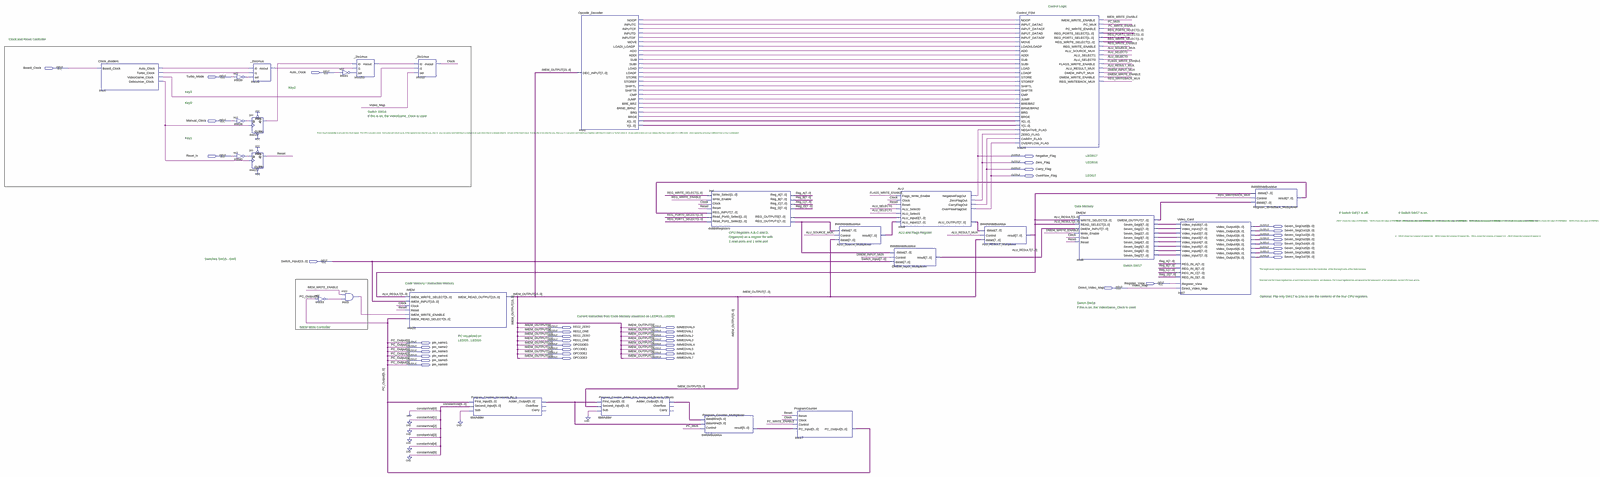
[diagram p0: schematic sheet, whole]
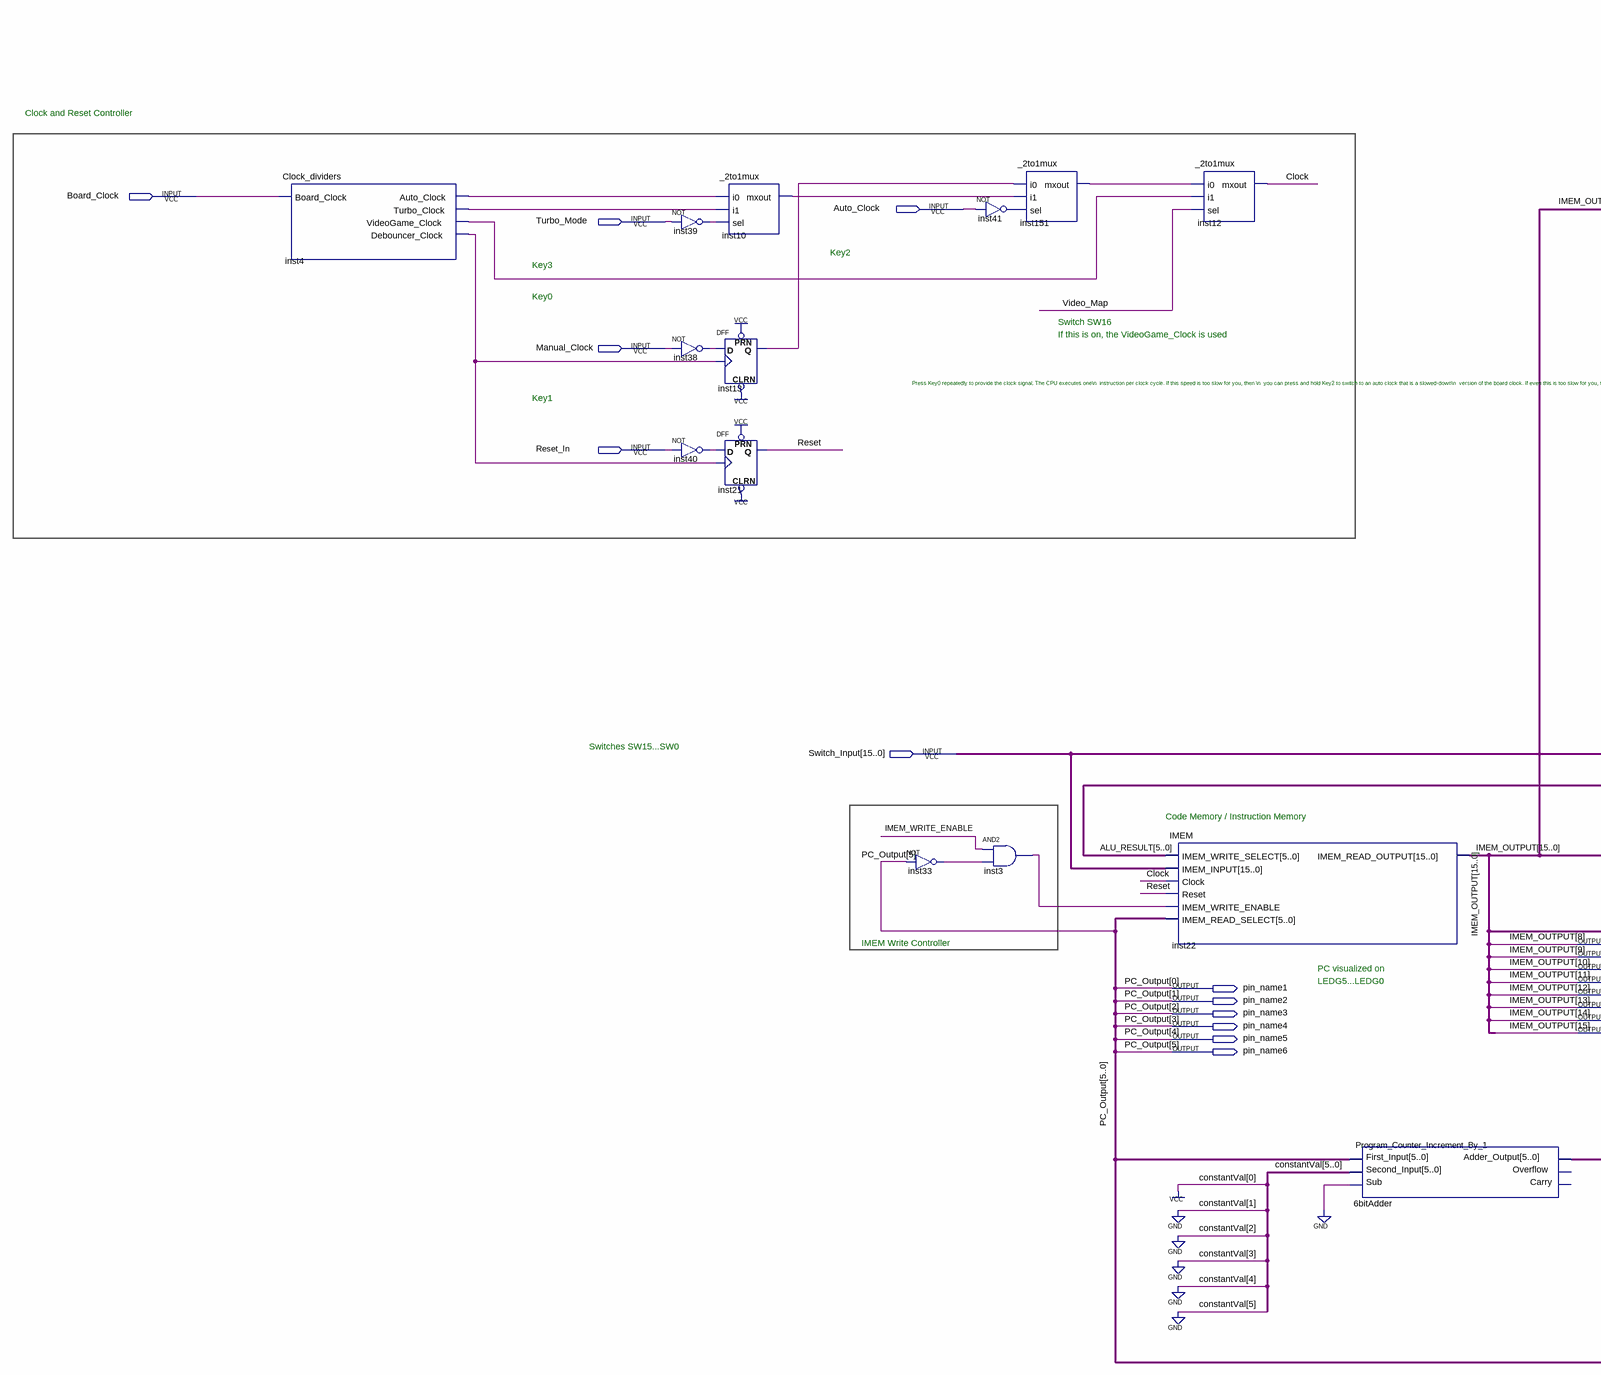
[diagram p1: schematic sheet, left part]
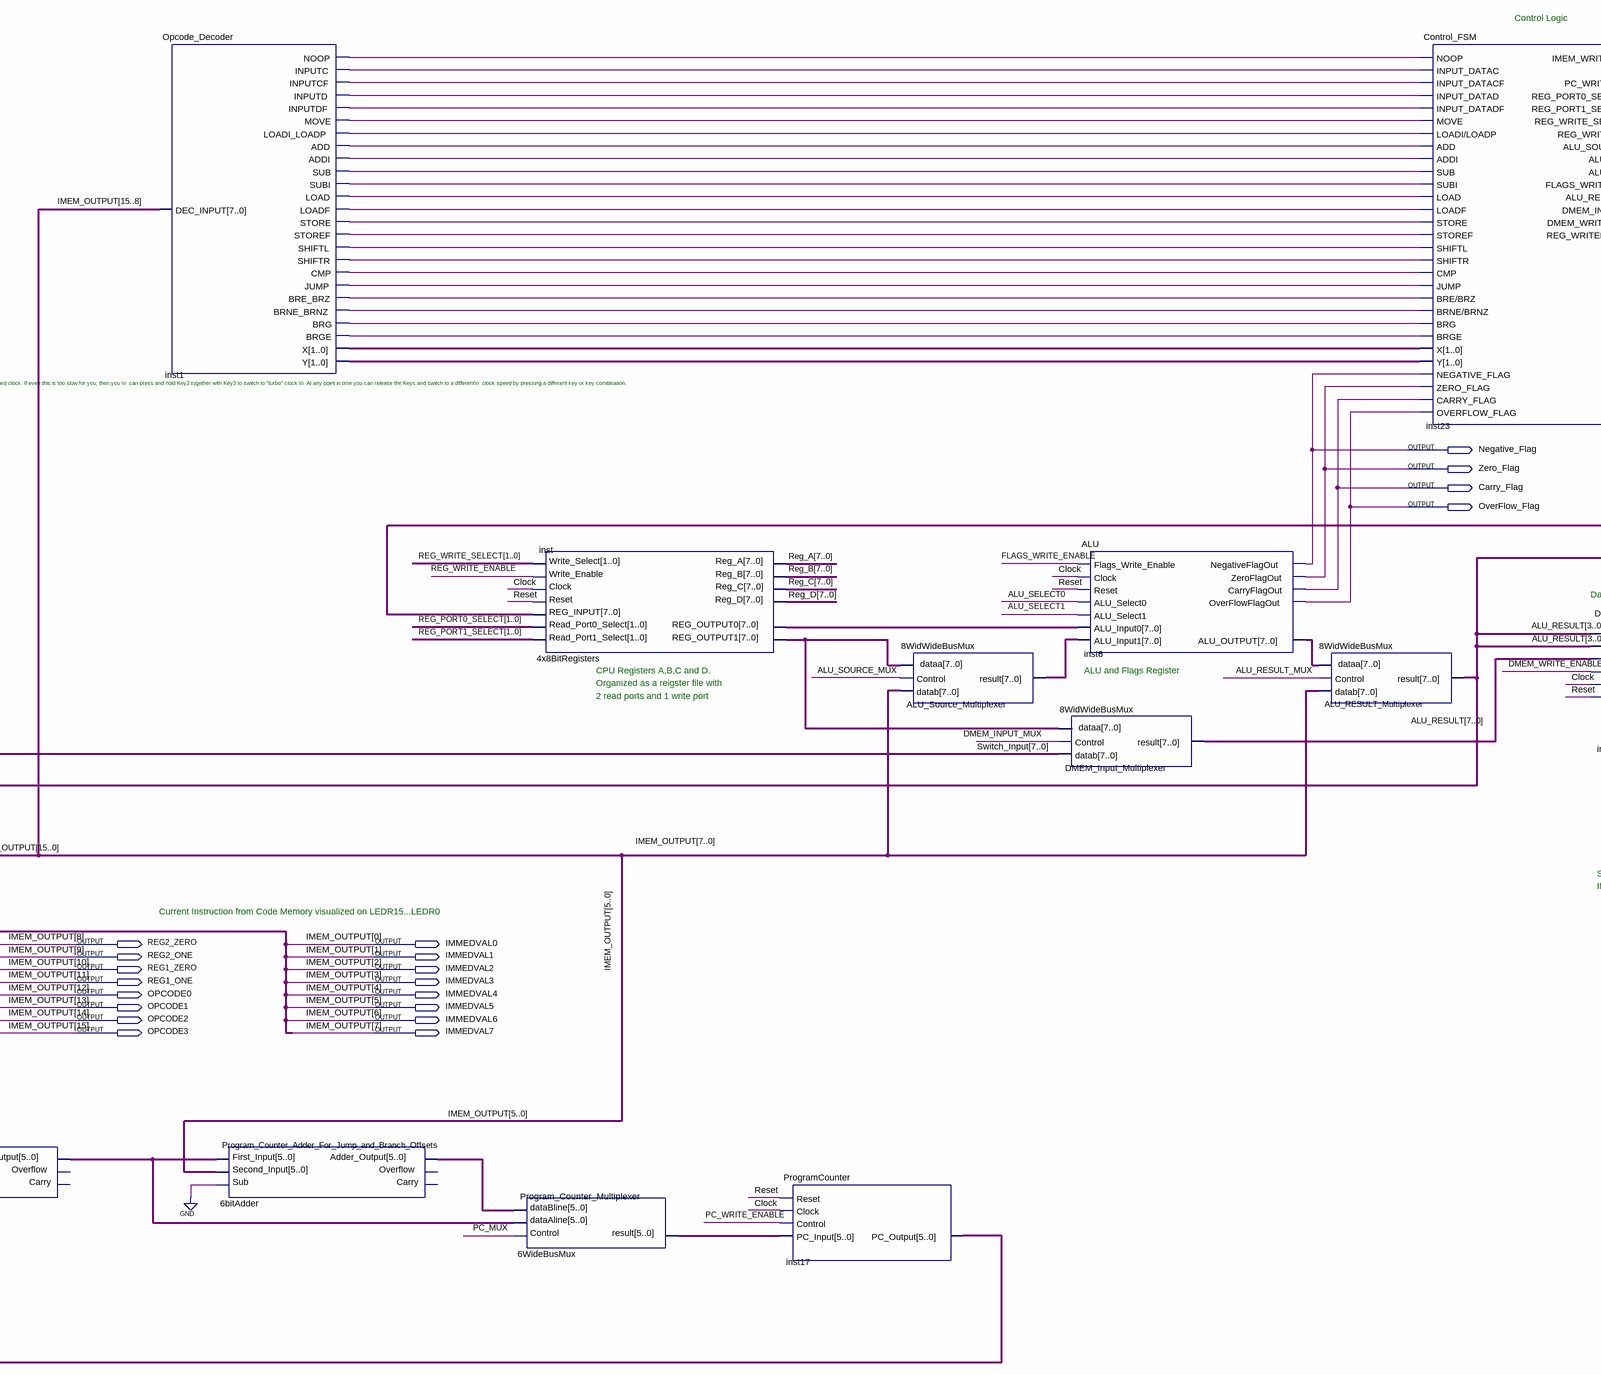
[diagram p2: schematic sheet, centre part]
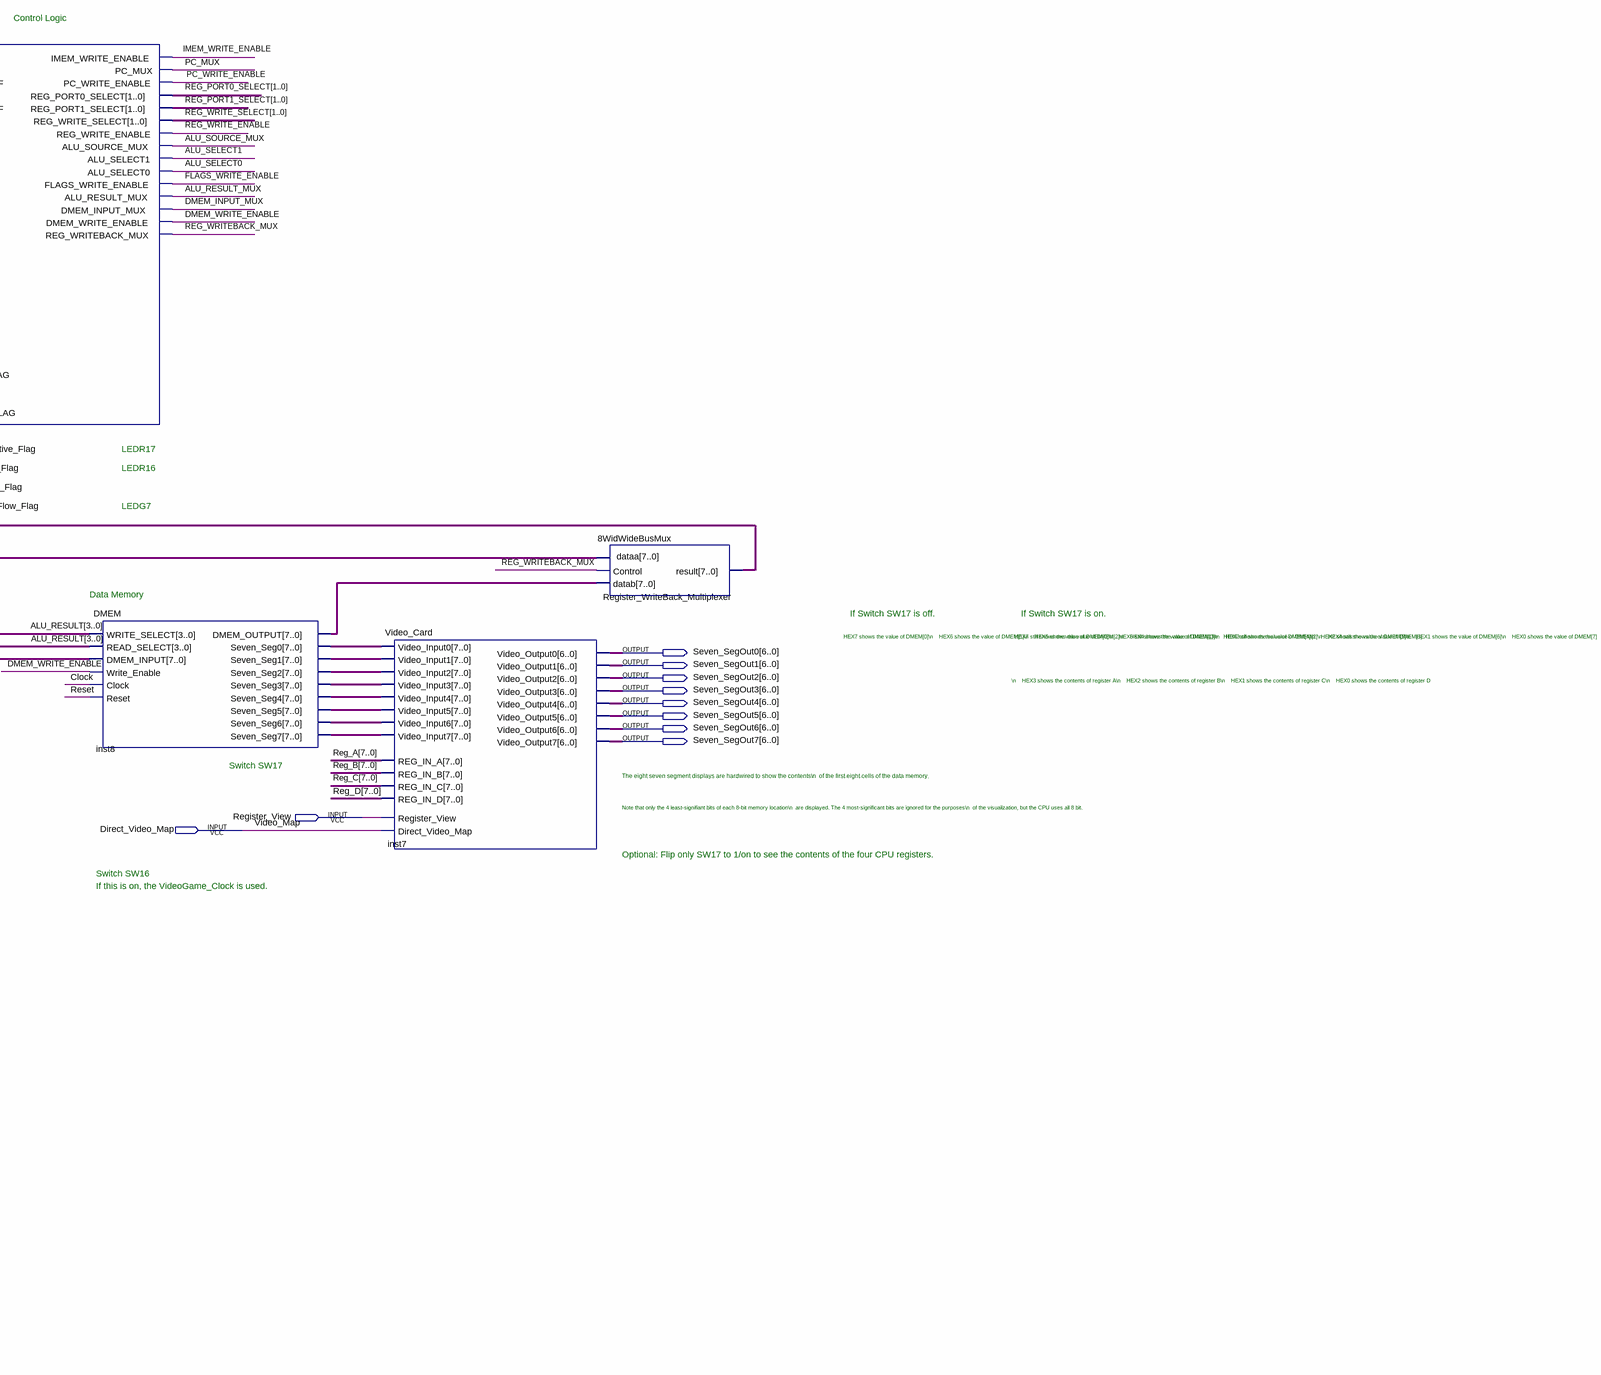
[diagram p3: schematic sheet, right part]
// Quartus schematic i281_CPU.bdf as structural Verilog: 27 symbols, 42 pins
module i281_CPU (
  input  Board_Clock,
  input  Auto_Clock,
  input  Turbo_Mode,
  input  Manual_Clock,
  input  Reset_In,
  input  [15:0] Switch_Input,
  input  Register_View,
  input  Direct_Video_Map,
  output Negative_Flag,
  output Zero_Flag,
  output Carry_Flag,
  output OverFlow_Flag,
  output [6:0] Seven_SegOut0,
  output [6:0] Seven_SegOut1,
  output [6:0] Seven_SegOut2,
  output [6:0] Seven_SegOut3,
  output [6:0] Seven_SegOut4,
  output [6:0] Seven_SegOut5,
  output [6:0] Seven_SegOut6,
  output [6:0] Seven_SegOut7,
  output REG2_ZERO,
  output IMMEDVAL0,
  output REG2_ONE,
  output IMMEDVAL1,
  output REG1_ZERO,
  output IMMEDVAL2,
  output REG1_ONE,
  output IMMEDVAL3,
  output pin_name1,
  output OPCODE0,
  output IMMEDVAL4,
  output pin_name2,
  output OPCODE1,
  output IMMEDVAL5,
  output pin_name3,
  output OPCODE2,
  output IMMEDVAL6,
  output pin_name4,
  output OPCODE3,
  output IMMEDVAL7,
  output pin_name5,
  output pin_name6
);

  wire ALU_RESULT_MUX, ALU_SELECT0, ALU_SELECT1, ALU_SOURCE_MUX, Clock, DMEM_INPUT_MUX, DMEM_WRITE_ENABLE,
       FLAGS_WRITE_ENABLE, IMEM_WRITE_ENABLE, inst1_add, inst1_addi, inst1_bre_brz, inst1_brg, inst1_brge,
       inst1_brne_brnz, inst1_cmp, inst1_inputc, inst1_inputcf, inst1_inputd, inst1_inputdf, inst1_jump,
       inst1_load, inst1_loadf, inst1_loadi_loadp, inst1_move, inst1_noop, inst1_shiftl, inst1_shiftr,
       inst1_store, inst1_storef, inst1_sub, inst1_subi, inst3_out, inst4_auto_clock, inst4_debouncer_clock,
       inst4_turbo_clock, inst4_videogame_clock, inst10_mxout, inst13_q, inst33_out, inst38_out, inst39_out,
       inst40_out, inst41_out, inst151_mxout, PC_MUX, PC_WRITE_ENABLE, REG_WRITE_ENABLE, REG_WRITEBACK_MUX,
       Reset;
  wire [1:0] inst1_x, inst1_y, REG_PORT0_SELECT, REG_PORT1_SELECT, REG_WRITE_SELECT;
  wire [5:0] Program_Counter_Adder_For_Jump_and_Branch_Offsets_adder_output,
       Program_Counter_Increment_By_1_adder_output, Program_Counter_Multiplexer_result;
  wire [7:0] ALU_RESULT, ALU_Source_Multiplexer_result, DMEM_Input_Multiplexer_result, inst6_alu_output,
       inst8_dmem_output, inst8_seven_seg0, inst8_seven_seg1, inst8_seven_seg2, inst8_seven_seg3,
       inst8_seven_seg4, inst8_seven_seg5, inst8_seven_seg6, inst8_seven_seg7, inst_reg_output0,
       inst_reg_output1, Reg_A, Reg_B, Reg_C, Reg_D, Register_WriteBack_Multiplexer_result;

  Clock_dividers inst4 (
    .Board_Clock(Board_Clock), .Auto_Clock(inst4_auto_clock), .Turbo_Clock(inst4_turbo_clock),
    .VideoGame_Clock(inst4_videogame_clock), .Debouncer_Clock(inst4_debouncer_clock));
  not inst39 (inst39_out, Turbo_Mode);
  not inst38 (inst38_out, Manual_Clock);
  not inst40 (inst40_out, Reset_In);
  _2to1mux inst10 (.i0(inst4_auto_clock), .i1(inst4_turbo_clock), .sel(inst39_out), .mxout(inst10_mxout));
  DFF inst13 (.CLRN(1'b1), .CLK(inst4_debouncer_clock), .D(inst38_out), .PRN(1'b1), .Q(inst13_q));
  DFF inst21 (.CLRN(1'b1), .CLK(inst4_debouncer_clock), .D(inst40_out), .PRN(1'b1), .Q(Reset));
  not inst33 (inst33_out, pin_name6);
  not inst41 (inst41_out, Auto_Clock);
  and inst3 (inst3_out, IMEM_WRITE_ENABLE, inst33_out);
  _2to1mux inst151 (.i0(inst13_q), .i1(inst10_mxout), .sel(inst41_out), .mxout(inst151_mxout));
  _2to1mux inst12 (.i0(inst151_mxout), .i1(inst4_videogame_clock), .sel(Direct_Video_Map), .mxout(Clock));
  IMEM inst22 (
    .Clock(Clock), .Reset(Reset),
    .IMEM_READ_SELECT({pin_name6, pin_name5, pin_name4, pin_name3, pin_name2, pin_name1}),
    .IMEM_WRITE_SELECT(ALU_RESULT[5:0]), .IMEM_INPUT(Switch_Input), .IMEM_WRITE_ENABLE(inst3_out),
    .IMEM_READ_OUTPUT({OPCODE3, OPCODE2, OPCODE1, OPCODE0, REG1_ONE, REG1_ZERO, REG2_ONE, REG2_ZERO, IMMEDVAL7, IMMEDVAL6, IMMEDVAL5, IMMEDVAL4, IMMEDVAL3, IMMEDVAL2, IMMEDVAL1, IMMEDVAL0}));
  \6bitAdder  Program_Counter_Increment_By_1 (
    .Sub(1'b0), .Second_Input(6'b000001),
    .First_Input({pin_name6, pin_name5, pin_name4, pin_name3, pin_name2, pin_name1}),
    .Adder_Output(Program_Counter_Increment_By_1_adder_output));  // open: Carry, Overflow
  Opcode_Decoder inst1 (
    .DEC_INPUT({OPCODE3, OPCODE2, OPCODE1, OPCODE0, REG1_ONE, REG1_ZERO, REG2_ONE, REG2_ZERO}),
    .NOOP(inst1_noop), .INPUTC(inst1_inputc), .INPUTCF(inst1_inputcf), .INPUTD(inst1_inputd),
    .INPUTDF(inst1_inputdf), .MOVE(inst1_move), .LOADI_LOADP(inst1_loadi_loadp), .ADD(inst1_add),
    .ADDI(inst1_addi), .SUB(inst1_sub), .SUBI(inst1_subi), .LOAD(inst1_load), .LOADF(inst1_loadf),
    .STORE(inst1_store), .STOREF(inst1_storef), .SHIFTL(inst1_shiftl), .SHIFTR(inst1_shiftr),
    .CMP(inst1_cmp), .JUMP(inst1_jump), .BRE_BRZ(inst1_bre_brz), .BRNE_BRNZ(inst1_brne_brnz),
    .BRG(inst1_brg), .BRGE(inst1_brge), .X(inst1_x), .Y(inst1_y));
  \6bitAdder  Program_Counter_Adder_For_Jump_and_Branch_Offsets (
    .Sub(1'b0), .Second_Input({IMMEDVAL5, IMMEDVAL4, IMMEDVAL3, IMMEDVAL2, IMMEDVAL1, IMMEDVAL0}),
    .First_Input(Program_Counter_Increment_By_1_adder_output),
    .Adder_Output(Program_Counter_Adder_For_Jump_and_Branch_Offsets_adder_output));  // open: Carry, Overflow
  \4x8BitRegisters  inst (
    .Read_Port1_Select(REG_PORT1_SELECT), .Read_Port0_Select(REG_PORT0_SELECT),
    .REG_INPUT(Register_WriteBack_Multiplexer_result), .Reset(Reset), .Clock(Clock),
    .Write_Enable(REG_WRITE_ENABLE), .Write_Select(REG_WRITE_SELECT), .Reg_A(Reg_A), .Reg_B(Reg_B),
    .REG_OUTPUT1(inst_reg_output1), .REG_OUTPUT0(inst_reg_output0), .Reg_C(Reg_C), .Reg_D(Reg_D));
  \6WideBusMux  Program_Counter_Multiplexer (
    .Control(PC_MUX), .dataAline(Program_Counter_Increment_By_1_adder_output),
    .dataBline(Program_Counter_Adder_For_Jump_and_Branch_Offsets_adder_output),
    .result(Program_Counter_Multiplexer_result));
  ProgramCounter inst17 (
    .Reset(Reset), .Clock(Clock), .Control(PC_WRITE_ENABLE), .PC_Input(Program_Counter_Multiplexer_result),
    .PC_Output({pin_name6, pin_name5, pin_name4, pin_name3, pin_name2, pin_name1}));
  \8WidWideBusMux  ALU_Source_Multiplexer (
    .Control(ALU_SOURCE_MUX), .dataa(inst_reg_output1),
    .datab({IMMEDVAL7, IMMEDVAL6, IMMEDVAL5, IMMEDVAL4, IMMEDVAL3, IMMEDVAL2, IMMEDVAL1, IMMEDVAL0}),
    .result(ALU_Source_Multiplexer_result));
  \8WidWideBusMux  DMEM_Input_Multiplexer (
    .Control(DMEM_INPUT_MUX), .dataa(inst_reg_output1), .datab(Switch_Input[7:0]),
    .result(DMEM_Input_Multiplexer_result));
  ALU inst6 (
    .ALU_Select0(ALU_SELECT0), .ALU_Input0(inst_reg_output0), .ALU_Select1(ALU_SELECT1),
    .ALU_Input1(ALU_Source_Multiplexer_result), .Clock(Clock), .Reset(Reset),
    .Flags_Write_Enable(FLAGS_WRITE_ENABLE), .ALU_OUTPUT(inst6_alu_output), .NegativeFlagOut(Negative_Flag),
    .ZeroFlagOut(Zero_Flag), .CarryFlagOut(Carry_Flag), .OverFlowFlagOut(OverFlow_Flag));
  \8WidWideBusMux  ALU_RESULT_Multiplexer (
    .Control(ALU_RESULT_MUX), .dataa(inst6_alu_output),
    .datab({IMMEDVAL7, IMMEDVAL6, IMMEDVAL5, IMMEDVAL4, IMMEDVAL3, IMMEDVAL2, IMMEDVAL1, IMMEDVAL0}),
    .result(ALU_RESULT));
  Control_FSM inst23 (
    .OVERFLOW_FLAG(OverFlow_Flag), .INPUT_DATACF(inst1_inputcf), .INPUT_DATADF(inst1_inputdf),
    .NEGATIVE_FLAG(Negative_Flag), .NOOP(inst1_noop), .INPUT_DATAC(inst1_inputc), .INPUT_DATAD(inst1_inputd),
    .MOVE(inst1_move), .ADD(inst1_add), .ADDI(inst1_addi), .SUB(inst1_sub), .SUBI(inst1_subi),
    .LOAD(inst1_load), .LOADF(inst1_loadf), .STORE(inst1_store), .STOREF(inst1_storef),
    .SHIFTL(inst1_shiftl), .SHIFTR(inst1_shiftr), .CMP(inst1_cmp), .ZERO_FLAG(Zero_Flag), .JUMP(inst1_jump),
    .\BRE/BRZ (inst1_bre_brz), .\BRNE/BRNZ (inst1_brne_brnz), .BRG(inst1_brg), .CARRY_FLAG(Carry_Flag),
    .BRGE(inst1_brge), .\LOADI/LOADP (inst1_loadi_loadp), .X(inst1_x), .Y(inst1_y),
    .IMEM_WRITE_ENABLE(IMEM_WRITE_ENABLE), .PC_MUX(PC_MUX), .PC_WRITE_ENABLE(PC_WRITE_ENABLE),
    .REG_PORT0_SELECT(REG_PORT0_SELECT), .REG_PORT1_SELECT(REG_PORT1_SELECT),
    .REG_WRITE_SELECT(REG_WRITE_SELECT), .REG_WRITE_ENABLE(REG_WRITE_ENABLE),
    .ALU_SOURCE_MUX(ALU_SOURCE_MUX), .ALU_SELECT1(ALU_SELECT1), .ALU_SELECT0(ALU_SELECT0),
    .FLAGS_WRITE_ENABLE(FLAGS_WRITE_ENABLE), .ALU_RESULT_MUX(ALU_RESULT_MUX),
    .DMEM_INPUT_MUX(DMEM_INPUT_MUX), .DMEM_WRITE_ENABLE(DMEM_WRITE_ENABLE),
    .REG_WRITEBACK_MUX(REG_WRITEBACK_MUX));
  DMEM inst8 (
    .Write_Enable(DMEM_WRITE_ENABLE), .WRITE_SELECT(ALU_RESULT[3:0]), .Clock(Clock),
    .DMEM_INPUT(DMEM_Input_Multiplexer_result), .Reset(Reset), .READ_SELECT(ALU_RESULT[3:0]),
    .Seven_Seg7(inst8_seven_seg7), .Seven_Seg6(inst8_seven_seg6), .Seven_Seg5(inst8_seven_seg5),
    .Seven_Seg4(inst8_seven_seg4), .Seven_Seg3(inst8_seven_seg3), .Seven_Seg2(inst8_seven_seg2),
    .Seven_Seg1(inst8_seven_seg1), .Seven_Seg0(inst8_seven_seg0), .DMEM_OUTPUT(inst8_dmem_output));
  Video_Card inst7 (
    .Direct_Video_Map(Direct_Video_Map), .Register_View(Register_View), .Video_Input0(inst8_seven_seg0),
    .Video_Input1(inst8_seven_seg1), .Video_Input2(inst8_seven_seg2), .Video_Input3(inst8_seven_seg3),
    .Video_Input4(inst8_seven_seg4), .Video_Input5(inst8_seven_seg5), .Video_Input6(inst8_seven_seg6),
    .Video_Input7(inst8_seven_seg7), .REG_IN_D(Reg_D), .REG_IN_C(Reg_C), .REG_IN_B(Reg_B), .REG_IN_A(Reg_A),
    .Video_Output0(Seven_SegOut0), .Video_Output1(Seven_SegOut1), .Video_Output2(Seven_SegOut2),
    .Video_Output3(Seven_SegOut3), .Video_Output4(Seven_SegOut4), .Video_Output5(Seven_SegOut5),
    .Video_Output6(Seven_SegOut6), .Video_Output7(Seven_SegOut7));
  \8WidWideBusMux  Register_WriteBack_Multiplexer (
    .Control(REG_WRITEBACK_MUX), .dataa(ALU_RESULT), .datab(inst8_dmem_output),
    .result(Register_WriteBack_Multiplexer_result));

  // Other names for the same wires on the sheet: IMEM_OUTPUT[15:0] = {OPCODE3, OPCODE2, OPCODE1, OPCODE0, REG1_ONE, REG1_ZERO, REG2_ONE, REG2_ZERO, IMMEDVAL7, IMMEDVAL6, IMMEDVAL5, IMMEDVAL4, IMMEDVAL3, IMMEDVAL2, IMMEDVAL1, IMMEDVAL0};
  //   PC_Output[5:0] = {pin_name6, pin_name5, pin_name4, pin_name3, pin_name2, pin_name1};
  //   Video_Map = Direct_Video_Map

  // Notes on the sheet:
  //   Control Logic
  //   Clock and Reset Controller
  //   Key2
  //   Key3
  //   Key0
  //   Switch SW16
  //   If this is on, the VideoGame_Clock is used
  //   Press Key0 repeatedly to provide the clock signal. The CPU executes one\n  instruction per clock cycle. If this speed is too slow for you, then \n  you can press and hold Key2 to switch to an auto clock that is a slowed-down\n  version of the board clock. If even this is too slow for you, then you \n  can press and hold Key2 together with Key3 to switch to "turbo" clock.\n  At any point in time you can release the Keys and switch to a different\n  clock speed by pressing a different key or key combination.
  //   Key1
  //   LEDR17
  //   LEDR16
  //   LEDG7
  //   Data Memory
  //   If Switch SW17 is off.
  //   If Switch SW17 is on.
  //       HEX7 shows the value of DMEM[0]\n    HEX6 shows the value of DMEM[1]\n    HEX5 shows the value of DMEM[2]\n    HEX4 shows the value of DMEM[3]\n    HEX3 shows the value of DMEM[4]\n    HEX2 shows the value of DMEM[5]\n    HEX1 shows the value of DMEM[6]\n    HEX0 shows the value of DMEM[7]
  //       HEX7 still shows the value of DMEM[0]\n    HEX6 still shows the value of DMEM[1]\n    HEX5 still shows the value of DMEM[2]\n    HEX4 still shows the value of DMEM[3]
  //   CPU Registers A,B,C and D.
  //   ALU and Flags Register
  //   Organized as a reigster file with
  //     \n    HEX3 shows the contents of register A\n    HEX2 shows the contents of register B\n    HEX1 shows the contents of register C\n    HEX0 shows the contents of register D
  //   2 read ports and 1 write port
  //   Switches SW15...SW0
  //   Switch SW17
  //   The eight seven segment displays are hardwired to show the contents\n  of the first eight cells of the data memory.
  //   Note that only the 4 least-signifiant bits of each 8-bit memory location\n  are displayed. The 4 most-significant bits are ignored for the purposes\n  of the visualization, but the CPU uses all 8 bit.
  //   Code Memory / Instruction Memory
  //   Optional: Flip only SW17 to 1/on to see the contents of the four CPU registers.
  //   Switch SW16
  //   If this is on, the VideoGame_Clock is used.
  //   Current Instruction from Code Memory visualized on LEDR15...LEDR0
  //   IMEM Write Controller
  //   PC visualized on
  //   LEDG5...LEDG0
endmodule
